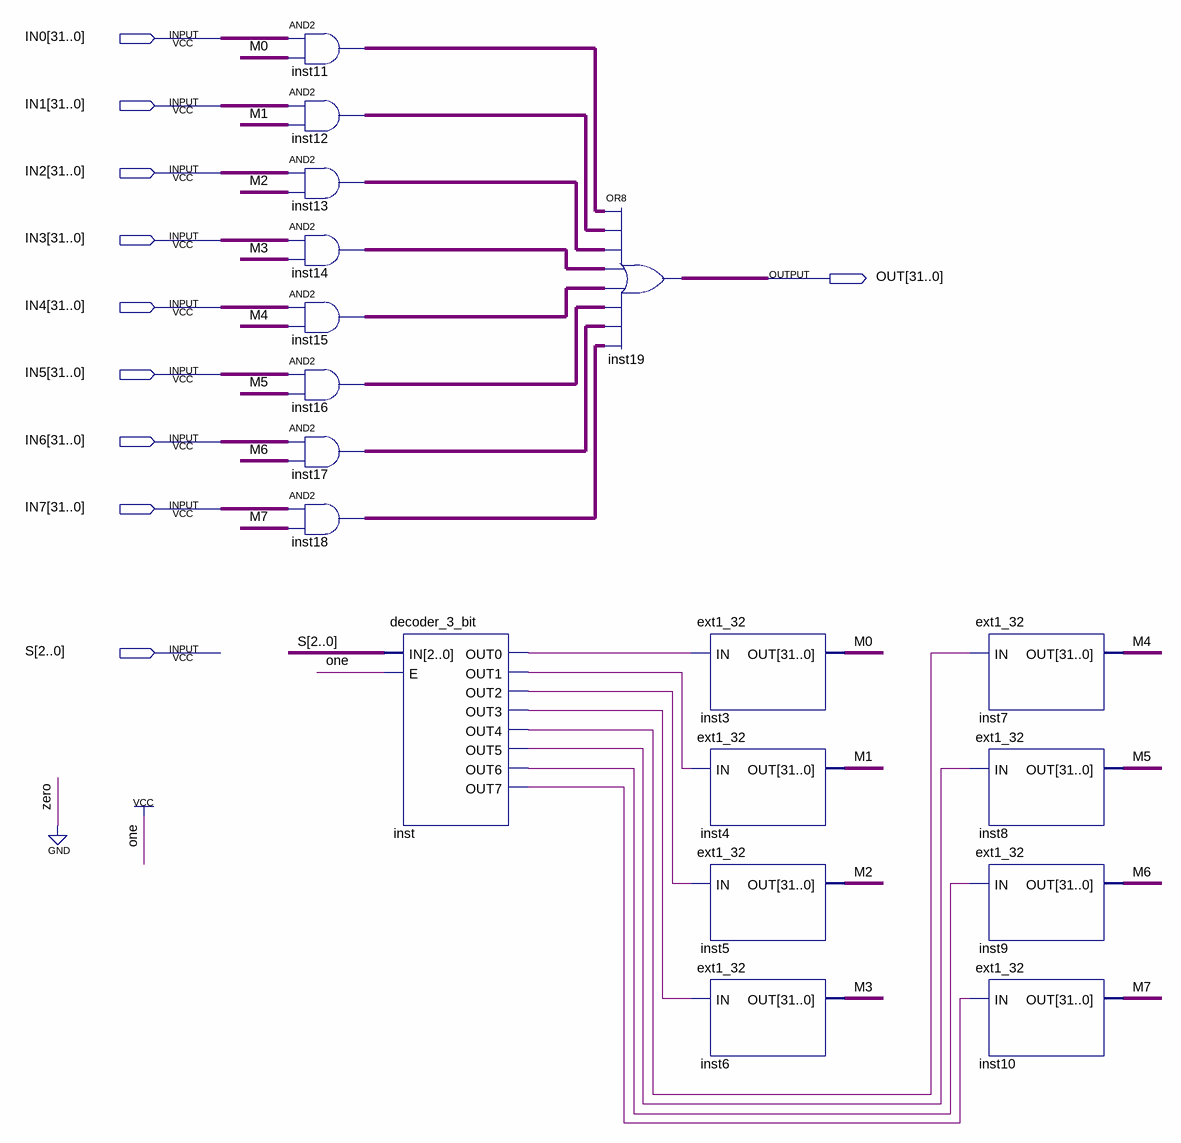
[diagram p0: schematic sheet]
// Quartus schematic mux8_32.bdf as structural Verilog: 18 symbols, 10 pins
module mux8_32 (
  input  [31:0] IN0,
  input  [31:0] IN1,
  input  [31:0] IN2,
  input  [31:0] IN3,
  input  [31:0] IN4,
  input  [31:0] IN5,
  input  [31:0] IN6,
  input  [31:0] IN7,
  input  [2:0] S,
  output [31:0] OUT
);

  wire inst_out0, inst_out1, inst_out2, inst_out3, inst_out4, inst_out5, inst_out6, inst_out7, M0, M1, M2,
       M3, M4, M5, M6, M7;
  wire [31:0] inst11_out, inst12_out, inst13_out, inst14_out, inst15_out, inst16_out, inst17_out, inst18_out;

  assign inst11_out = IN0 & {32{M0}};  // AND2 inst11, 32 bits wide
  assign inst12_out = IN1 & {32{M1}};  // AND2 inst12, 32 bits wide
  assign inst13_out = IN2 & {32{M2}};  // AND2 inst13, 32 bits wide
  assign inst14_out = IN3 & {32{M3}};  // AND2 inst14, 32 bits wide
  assign inst15_out = IN4 & {32{M4}};  // AND2 inst15, 32 bits wide
  assign inst16_out = IN5 & {32{M5}};  // AND2 inst16, 32 bits wide
  assign inst17_out = IN6 & {32{M6}};  // AND2 inst17, 32 bits wide
  assign inst18_out = IN7 & {32{M7}};  // AND2 inst18, 32 bits wide
  decoder_3_bit inst (
    .IN(S), .E(1'b1), .OUT0(inst_out0), .OUT1(inst_out1), .OUT2(inst_out2), .OUT3(inst_out3),
    .OUT4(inst_out4), .OUT5(inst_out5), .OUT6(inst_out6), .OUT7(inst_out7));
  assign OUT = inst11_out | inst12_out | inst13_out | inst14_out | inst15_out | inst16_out | inst17_out | inst18_out;  // OR8 inst19, 32 bits wide
  ext1_32 inst3 (.IN(inst_out0), .OUT(M0));
  ext1_32 inst4 (.IN(inst_out1), .OUT(M1));
  ext1_32 inst5 (.IN(inst_out2), .OUT(M2));
  ext1_32 inst6 (.IN(inst_out3), .OUT(M3));
  ext1_32 inst7 (.IN(inst_out4), .OUT(M4));
  ext1_32 inst8 (.IN(inst_out5), .OUT(M5));
  ext1_32 inst9 (.IN(inst_out6), .OUT(M6));
  ext1_32 inst10 (.IN(inst_out7), .OUT(M7));
endmodule
